# Altium schematic sheet AT_LINK.SchDoc
size B; SheetNumber: 1; SheetTotal: 1
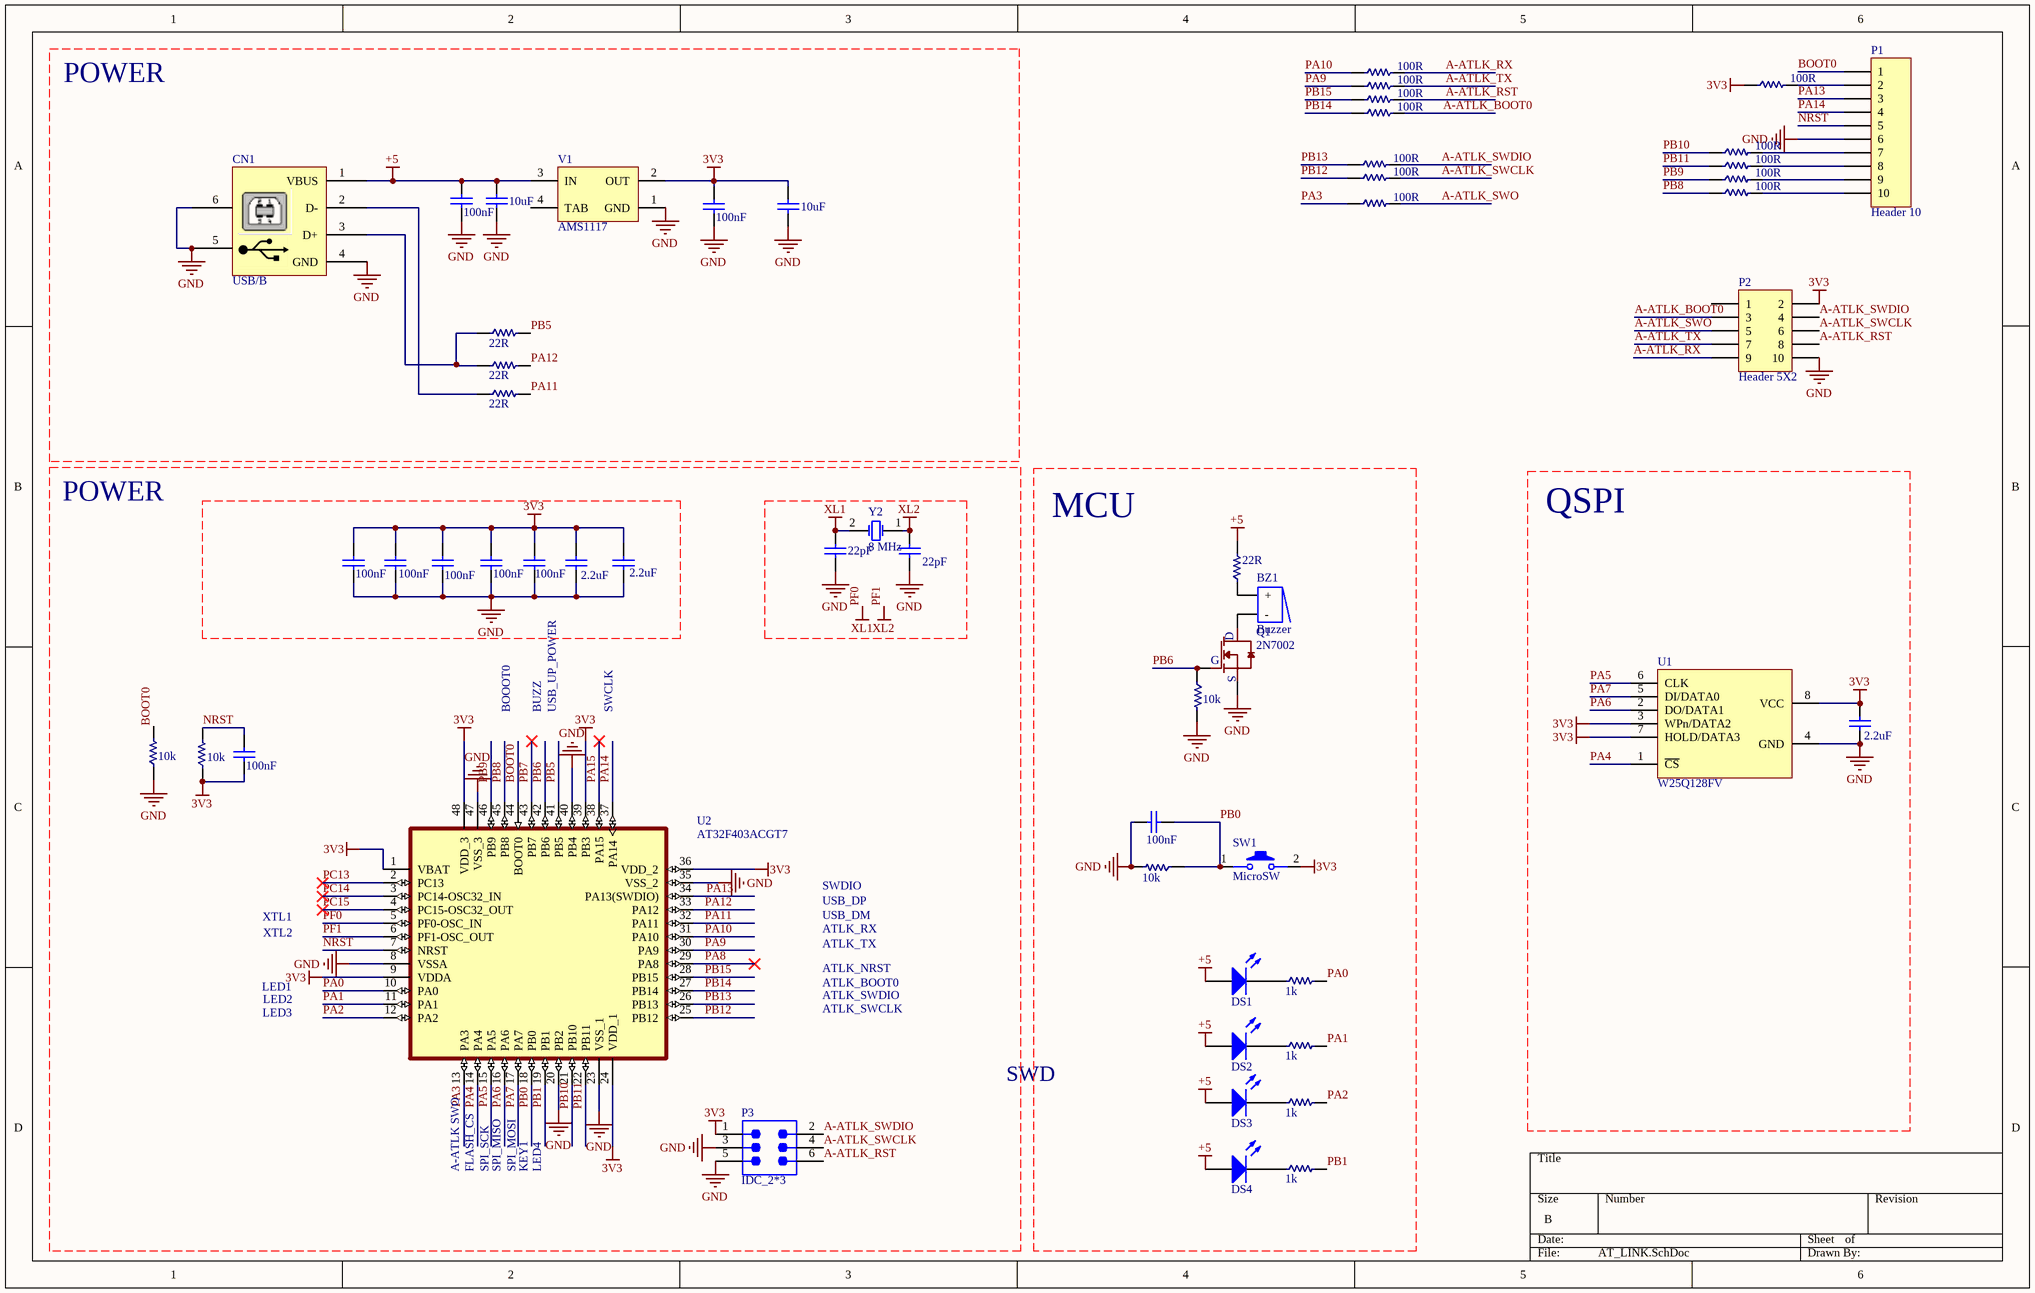
[diagram p0: AT_LINK.SchDoc]

## Parts
BZ1  Buzzer  [Buzzer 3M]
C1  100nF  [CAP 0603]
C2  10uF  [CAP1206]
C3  100nF  [CAP 0603]
C4  10uF  [CAP1206]
C5  22pF  [CAP 0603]
C6  100nF  [CAP 0603]
C7  2.2uF  [CAP 0603]
C8  22pF  [CAP 0603]
C9  100nF  [CAP 0603]
C10  100nF  [CAP 0603]
C11  100nF  [CAP 0603]
C12  100nF  [CAP 0603]
C13  2.2uF  [CAP 0603]
C14  2.2uF  [CAP 0603]
C15  100nF  [CAP 0603]
C16  100nF  [CAP 0603]
CN1  USB/B  [USB_B]
DS1  75 mW & 20 mA  [LED 0805 SMD]  (value not drawn)
DS2  75 mW & 20 mA  [LED 0805 SMD]  (value not drawn)
DS3  75 mW & 20 mA  [LED 0805 SMD]  (value not drawn)
DS4  75 mW & 20 mA  [LED 0805 SMD]  (value not drawn)
P1  Header 10  [HDR1X10]
P2  Header 5X2  [HDR2X5]
P3  IDC_2*3  [HDB-6 right]
Q1  2N7002  [SOT23_BEC_M]
res1  100R  [RES1206]
res2  100R  [RES1206]
res3  100R  [RES1206]
res4  100R  [RES1206]
res5  100R  [RES1206]
res6  100R  [RES1206]
res7  100R  [RES1206]
res8  100R  [RES1206]
res9  100R  [RES1206]
res10  100R  [RES1206]
res11  100R  [RES1206]
res12  100R  [RES1206]
res14  22R  [RES1206]
res15  22R  [RES1206]
res16  22R  [RES1206]
res17  22R  [RES1206]
res18  10k  [RES0603]
res19  10k  [RES0603]
res20  10k  [RES0603]
res21  10k  [RES0603]
res22  1k  [RES1206]
res23  1k  [RES1206]
res24  1k  [RES1206]
res25  1k  [RES1206]
SW1  MicroSW  [SW-Tactile-SMD]
U1  W25Q128FV  [SOIC-8W]
U2  AT32F403ACGT7  [LQFP48_N]
V1  AMS1117  [MP04A_N]
Y2  value 8 MHz  [Crystal DIP]  (hidden comment: 8MHZ)

## Nets
3V3: C3.2 C4.2 C6.2 C7.2 C9.2 C10.2 C11.2 C12.2 C13.2 C14.2 C15.1 P2.2 P3.1 res3.1 res20.1 SW1.2 U1.3(WPn/DATA2) U1.7(HOLD/DATA3) U1.8(VCC) U2.1(VBAT) U2.9(VDDA) U2.24(VDD_1) U2.36(VDD_2) U2.39(PB3) U2.48(VDD_3) V1.2(OUT)
+5: C1.2 C2.2 CN1.1(VBUS) DS1.1(A) DS2.1(A) DS3.1(A) DS4.1(A) res17.2 V1.3(IN)
GND: C1.1 C2.1 C3.1 C4.1 C5.1 C6.1 C7.1 C8.2 C9.1 C10.1 C11.1 C12.1 C13.1 C14.1 C16.2 CN1.4(GND) CN1.5 CN1.6 P1.6 P2.10 P3.3 P3.5 Q1.2(S) res18.2 res19.1 res21.2 U1.4(GND) U2.8(VSSA) U2.20(PB2) U2.23(VSS_1) U2.35(VSS_2) U2.40(PB4) U2.47(VSS_3) V1.1(GND)
PF0: C5.2 U2.5(PF0-OSC_IN) Y2.2(OSC2)  [also labelled XL1]
PF1: C8.1 U2.6(PF1-OSC_OUT) Y2.1(OSC1)  [also labelled XL2]
A-ATLK_BOOT0: P2.3 res5.2
A-ATLK_RST: P2.8 P3.6 res4.2
A-ATLK_RX: P2.9 res1.2
A-ATLK_SWCLK: P2.6 P3.4 res9.2
A-ATLK_SWDIO: P2.4 P3.2 res7.2
A-ATLK_SWO: P2.5 res12.2
A-ATLK_TX: P2.7 res2.2
BOOT0: P1.1 res19.2 U2.44(BOOT0)
NRST: C15.2 P1.5 res20.2 U2.7(NRST)
PA0: res22.2 U2.10(PA0)
PA1: res23.2 U2.11(PA1)
PA2: res24.2 U2.12(PA2)
PA3: res12.1 U2.13(PA3)
PA4: U1.1(~{CS}) U2.14(PA4)
PA5: U1.6(CLK) U2.15(PA5)
PA6: U1.2(DO/DATA1) U2.16(PA6)
PA7: U1.5(DI/DATA0) U2.17(PA7)
PA8: U2.29(PA8)
PA9: res2.1 U2.30(PA9)
PA10: res1.1 U2.31(PA10)
PA11: res16.2 U2.32(PA11)
PA12: res15.2 U2.33(PA12)
PA13: P1.3 U2.34(PA13(SWDIO))
PA14: P1.4 U2.37(PA14)
PA15: U2.38(PA15)
PB0: C16.1 res21.1 SW1.1(Button) U2.18(PB0)
PB1: res25.2 U2.19(PB1)
PB5: res14.2 U2.41(PB5)
PB6: Q1.1(G) res18.1 U2.42(PB6)
PB7: U2.43(PB7)
PB8: res11.1 U2.45(PB8)
PB9: res10.1 U2.46(PB9)
PB10: res6.1 U2.21(PB10)
PB11: res8.1 U2.22(PB11)
PB12: res9.1 U2.25(PB12)
PB13: res7.1 U2.26(PB13)
PB14: res5.1 U2.27(PB14)
PB15: res4.1 U2.28(PB15)
PC13: U2.2(PC13)
PC14: U2.3(PC14-OSC32_IN)
PC15: U2.4(PC15-OSC32_OUT)
NetBZ1_1: BZ1.1(+) res17.1
NetBZ1_2: BZ1.2(-) Q1.3(D)
NetCN1_2: CN1.2(D-) res16.1
NetCN1_3: CN1.3(D+) res14.1 res15.1
NetDS1_2: DS1.2(K) res22.1
NetDS2_2: DS2.2(K) res23.1
NetDS3_2: DS3.2(K) res24.1
NetDS4_2: DS4.2(K) res25.1
NetP1_2: P1.2 res3.2
NetP1_7: P1.7 res6.2
NetP1_8: P1.8 res8.2
NetP1_9: P1.9 res10.2
NetP1_10: P1.10 res11.2

Not connected (* = marked no-connect by the designer): P2 1; V1 4(TAB)

## Notes on the sheet
- POWER
- MCU
- QSPI
- BOOOT0
- BUZZ
- USB_UP_POWER
- SWCLK
- USB_DP
- SWDIO
- XTL1
- XTL2
- ATLK_NRST
- ATLK_TX
- ATLK_RX
- USB_DM
- LED1
- LED3
- LED2
- ATLK_SWCLK
- ATLK_SWDIO
- ATLK_BOOT0
- SWD
- A-ATLK SWO
- FLASH_CS
- SPI_SCK
- SPI_MISO
- SPI_MOSI
- KEY1
- LED4

## Library data of the parts
BZ1 = BUZZER 5V: manufacture p-n: BUZZER 12A05; value: 10V 14V Current 30mA) ; RADIAL 12x10 mm; power: CHINA; LIBRARY PATCH: NKH_Contacts.SchLib; Rahkaran: 1011600143; part: BUZZER 5V; case: Cylindrical; supplier1: javan; supplier1 p-n: BUZZER 12A05; Footprint Patch: NKH_Contacts.PcbLib; manufacture: BUZZER 12A05
C1 C3 C6 C9-C12 C15 C16 = Cap-smd-0603-100nf: cap_no_polar_seramic_multilayer; manufacture: Multilayer Ceramic Capacitors MLCC - SMD/SMT; manufacture p-n: VJ0603Y104KXACW1BC; LIBRARY PATCH: R_C_D_T.SchLib; Rahkaran: ‎1010600299; value: 100nf; part: Cap-smd-0603-100nf; case: 603; supplier1: javan; supplier1 p-n: 100NF (0603) 50V 10% X7R (VISHAY); Footprint Patch: R_C_D_T.PcbLib
C2 C4 = Cap-smd-1206-10uf: cap_no_polar_seramic_multilayer; manufacture: Samwha Capacitor; manufacture p-n: CS3216X5R106K250NRI; LIBRARY PATCH: R_C_D_T.SchLib; Rahkaran: 1010600295; value: 10uf; part: Cap-smd-1206-10uf; case: 1206; supplier1: javan; supplier1 p-n: 10UF (1206) 25V X5R; Footprint Patch: R_C_D_T.PcbLib
C5 C8 = Cap-smd-0603-22pf: cap_no_polar_seramic_multilayer; manufacture: Fenghua Advanced Technology; manufacture p-n: 0603CG220J500NT; LIBRARY PATCH: R_C_D_T.SchLib; Rahkaran: 1010600306; value: 22pf; part: Cap-smd-0603-22pf; case: 603; supplier1: javan; supplier1 p-n: 22pF (0603) 50V 10% X7R; Footprint Patch: R_C_D_T.PcbLib
C7 C13 C14 = Cap-smd-0603-2.2uf: cap_no_polar_seramic_multilayer; manufacture: Multilayer Ceramic Capacitors MLCC - SMD/SMT; manufacture p-n: VJ0603Y104KXACW1BC; LIBRARY PATCH: R_C_D_T.SchLib; Rahkaran: ‎1010600052; value: 2.2uf; part: Cap-smd-0603-2.2uf; case: 603; supplier1: javan; supplier1 p-n: 2.2UF (0603) 50V 10% X7R (VISHAY); Footprint Patch: R_C_D_T.PcbLib
CN1 = USB_B: USB Connector-B Type; manufacture p-n: USB B F RA; Designer: Eng. Saeid Jorablo; Company: DASE Co; power: CHINA; LIBRARY PATCH: NKH_Contacts.SchLib; Rahkaran: ‎1011100159; Adding Date: 10/26/2010; part: USB_B; case: Connector; manufacture: CHINA; supplier1: javan; supplier1 p-n: USB B F RA; Footprint Patch: NKH_Contacts.PcbLib
DS1-DS4 = LED_0805_Red: manufacture: China; manufacture p-n: LED (0805) R; Color: RED; LIBRARY PATCH: R_C_D_T.SchLib; Rahkaran: ‎1010000026; Value: 75 mW & 20 mA; part: LED_0805_Red; supplier1: javan; supplier1 p-n: LED (0805) R; Footprint Patch: R_C_D_T.PcbLib
P1 = Header 10: Header, 10-Pin; LatestRevisionDate: 17-Jul-2002; LatestRevisionNote: Re-released for DXP Platform.; Publisher: Altium Limited
P2 = Header 5X2: Header, 5-Pin, Dual row; LatestRevisionDate: 17-Jul-2002; LatestRevisionNote: Re-released for DXP Platform.; Publisher: Altium Limited
P3 = HDB-2*3 Right: LIBRARY PATCH: NKH_Contacts.SchLib; Rahkaran: ‎1011100150; part: HDB-2*3 Right; supplier1: javan; Footprint Patch: NKH_Contacts.PcbLib
Q1 = Mosfet-n-channel-2n7002: manufacture: Toshiba Corporation; manufacture p-n: T2N7002AK,LM; LIBRARY PATCH: R_C_D_T.SchLib; Rahkaran: ‎1010301739; part: Mosfet-n-channel-2n7002; supplier1: javan; supplier1 p-n: 2N7002A; Footprint Patch: R_C_D_T.PcbLib
res1-res12 = resistor-smd-1206-100R: manufacture: ANHUI VICO TECHNOLOGIES CO.; manufacture p-n: 100R (1206) 1%; designer: rashid_behdarvand; LIBRARY PATCH: R_C_D_T.SchLib; Rahkaran: ‎1012000603; part: resistor-smd-1206-100R; value: 100R; case: 1206; supplier1: javan; supplier1 p-n: 100R (1206) 1%; Footprint Patch: R_C_D_T.PcbLib
res14-res17 = resistor-smd-1206-22R: manufacture: ANHUI VICO TECHNOLOGIES CO.; manufacture p-n: 22R (1206) 1%; designer: rashid_behdarvand; LIBRARY PATCH: R_C_D_T.SchLib; Rahkaran: ‎1012001762; part: resistor-smd-1206-22R; value: 22R; case: 1206; supplier1: javan; supplier1 p-n: 22R (1206) 1%; Footprint Patch: R_C_D_T.PcbLib
res18-res21 = resistor-smd-0603-10k: manufacture: ANHUI VICO TECHNOLOGIES CO.; manufacture p-n: 10K (0603) 1%; designer: rashid_behdarvand; LIBRARY PATCH: R_C_D_T.SchLib; Rahkaran: 1012000580; part: resistor-smd-0603-10k; value: 10k; case: 603; supplier1: javan; supplier1 p-n: 10K (0603) 1%; Footprint Patch: R_C_D_T.PcbLib
res22-res25 = resistor-smd-1206-1k: manufacture: ANHUI VICO TECHNOLOGIES CO.; manufacture p-n: 1K (1206) 1%; designer: rashid_behdarvand; LIBRARY PATCH: R_C_D_T.SchLib; Rahkaran: 1012000595; part: resistor-smd-1206-1k; value: 1k; case: 1206; supplier1: javan; supplier1 p-n: 1K (1206) 1%; Footprint Patch: R_C_D_T.PcbLib
SW1 = MicroSW_SMD_2Pin: manufacture: CHINA; manufacture p-n: TSUY-3SL; value: Switch; LIBRARY PATCH: NKH_Contacts.SchLib; Rahkaran: ‎1011801616; part: MicroSW_SMD_2Pin; supplier1: javan; supplier1 p-n: TSUY-3SL; Footprint Patch: NKH_Contacts.PcbLib
U1 = W25Q128FV: manufacture: Winbond Electronics; manufacture p-n: W25Q128FVSIG; value: 16M x 8,104MHZ; LIBRARY PATCH: NKH_IC.SchLib; Rahkaran: ‎1012300116; part: W25Q128FV; case: SOW-8; supplier1: javan; supplier1 p-n: W25Q128FVSIG; Footprint Patch: NKH_IC.PcbLib
U2 = AT32F403ACGT7: manufacture: Artery; value: 1024 Kbytes; LIBRARY PATCH: NKH_IC.SchLib; part: AT32F403ACGT7; case: LQFP-48; supplier1 p-n: AT32F403ACGT7; Footprint Patch: NKH_IC.PcbLib
V1 = LM1117IMP-3V3: x.x Volt, 800mA Low-Dropout Linear Regulator, 4-pin SOT-223; PartNumber: LM1117IMP-3.3; Manufacturer: National Semiconductor; PackageTopMarking: XYTT*N05B; PowerWise: N; CompType: LDO IC; value: 3v3out,Current : 800mA , Input Voltage : 15V; LIBRARY PATCH: NKH_IC.SchLib; Published: 4-Dec-2008; DatasheetVersion: Apr-2006; PackageVersion: revB, Apr-2003; PackageReference: MP04A; Publisher: Altium Limited; PackageDescription: Molded SOT-223, 6.50 x 3.56 x 1.6mm Body, 4 Lead, 2.3mm Pitch; Supplier 1: Farnell; Supplier Part Number 1: 7614123; RoHS: N; PinCount: 4; Code_JEDEC: TO-261-AA; Code_IPC: SOT223-4; ComponentLink1Description: LM1117 Datasheet; ComponentLink1URL: http://www.national.com/ds/LM/LM1117.pdf; ComponentLink2Description: LM1117 Web Page; ComponentLink2URL: http://www.national.com/pf/LM/LM1117.html; ComponentLink3Description: MP04A Package Page; ComponentLink3URL: http://www.national.com/packaging/folders/mp04a.html; part: LM1117IMP-3V3; case: SOT-223; manufacture: National Semiconductor; manufacture p-n: LM1117IMP-3.3; supplier1: javan; supplier1 p-n: LM1117IMP-3.3; Footprint Patch: NKH_IC.PcbLib
Y2 = Crystal SMD - 8MHZ: XTAL Crystal; manufacture: YJF; manufacture p-n: CRYSTAL 8.000 MHZ SMD 10PPM; Company: E.P.I.L; LIBRARY PATCH: R_C_D_T.SchLib; Rahkaran: ‎1011700776; Design Date: 11/04/2011; part: Crystal SMD - 8MHZ; supplier1: javan; supplier1 p-n: CRYSTAL 8.000 MHZ SMD 10PPM; Footprint Patch: R_C_D_T.PcbLib